# EasyEDA schematic SCH_RE2-YM2612-3438-v0.6_2024-08-18.json

## Sheets
1 MegaMod: TITLE: Sheet_1; REV: 1.0; Date: 2023-11-14; Sheet: 1/1; Drawn By: Denjhang; Company: Your Company
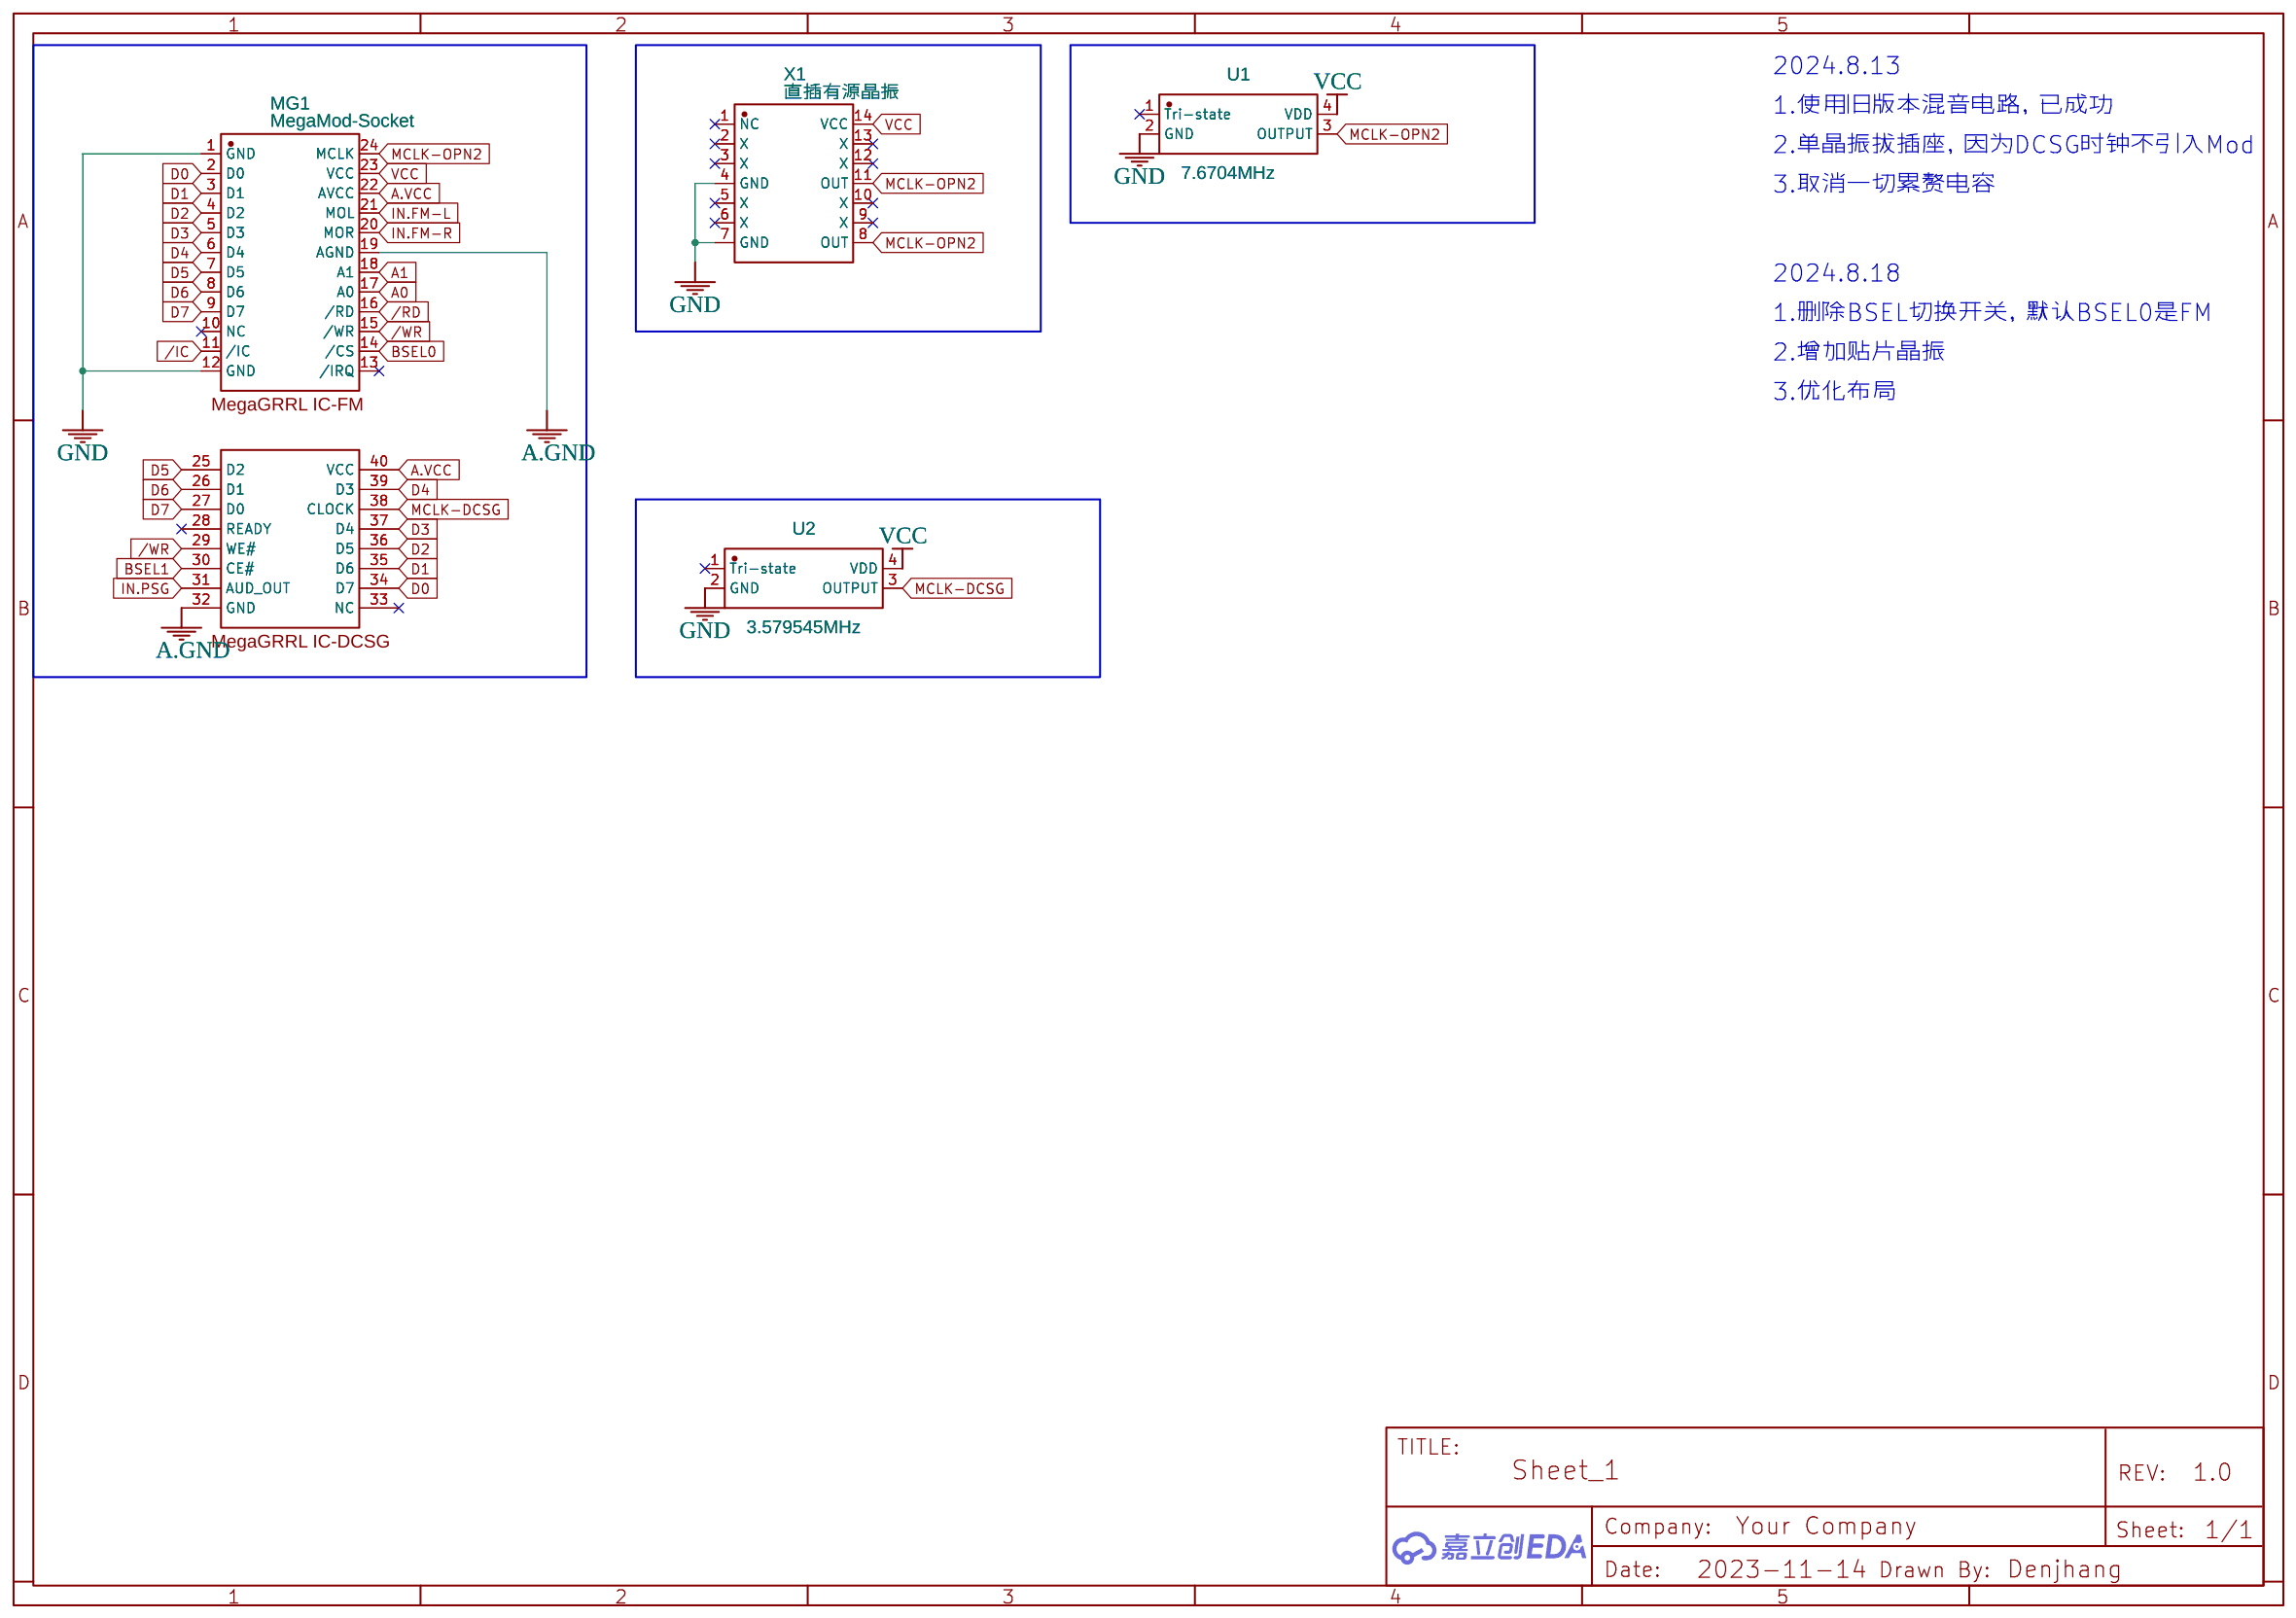
[diagram p0: MegaMod]
2 Mixer
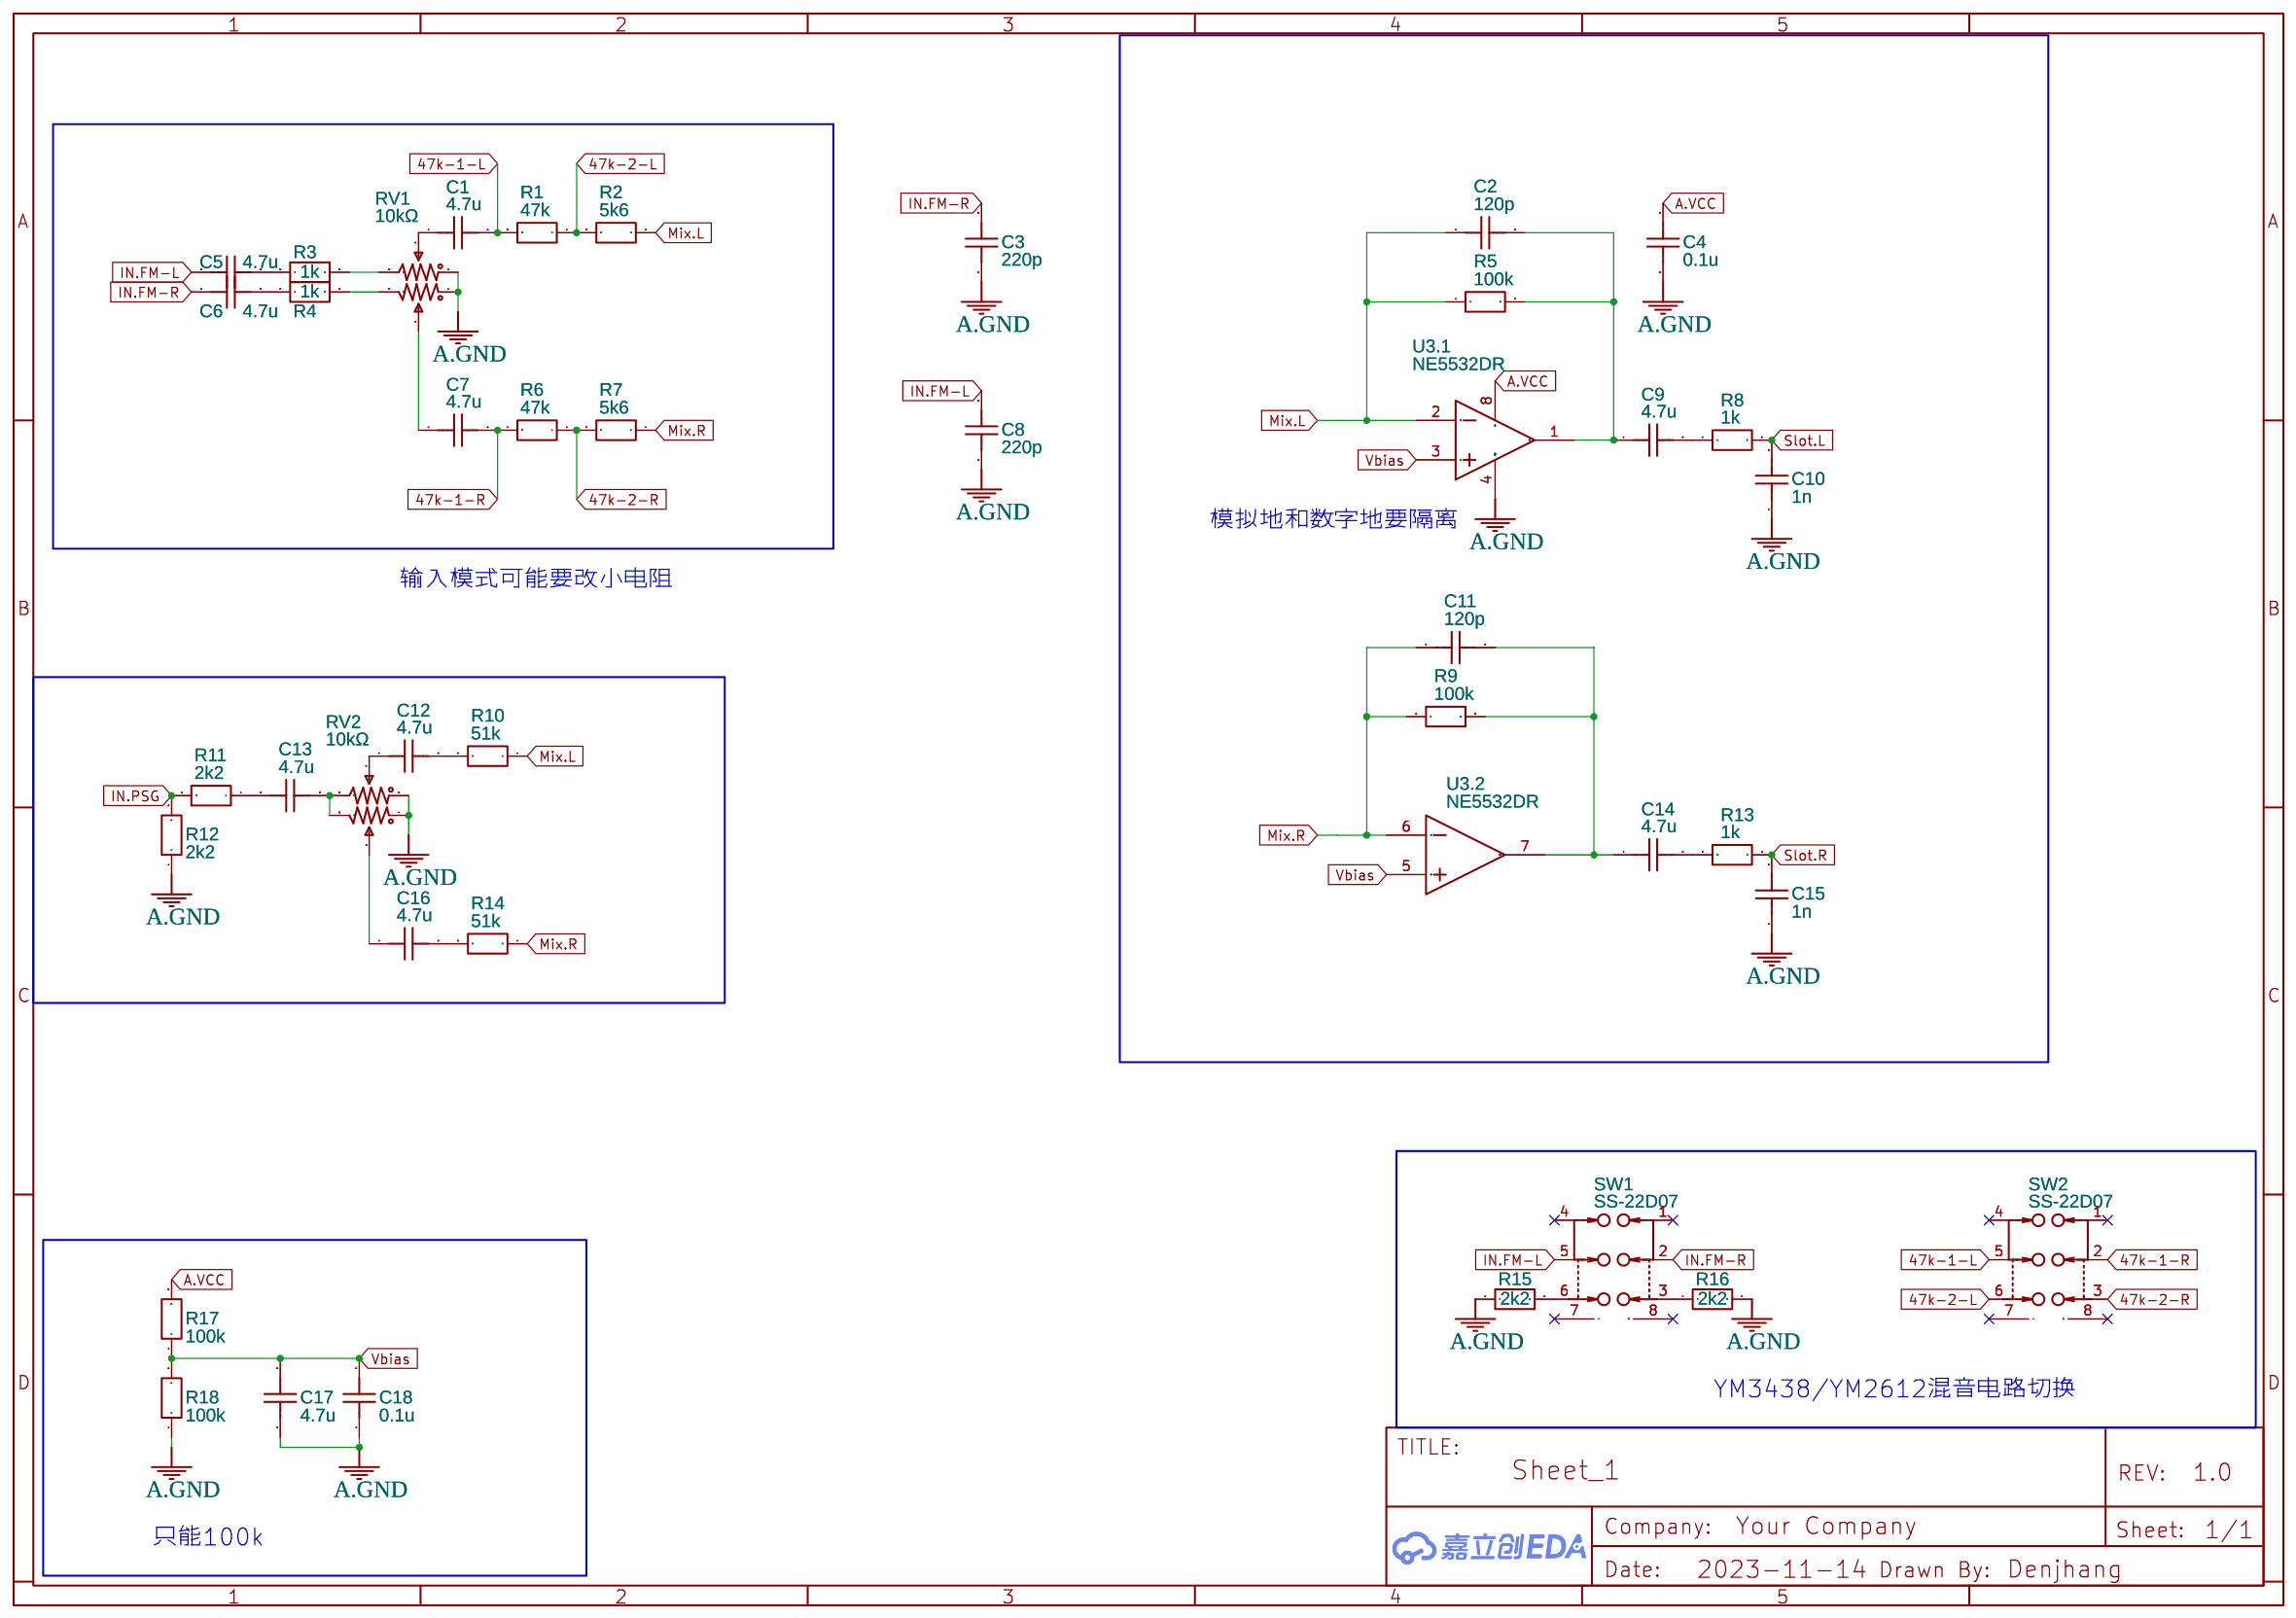
[diagram p1: Mixer]
3 RE-Birth
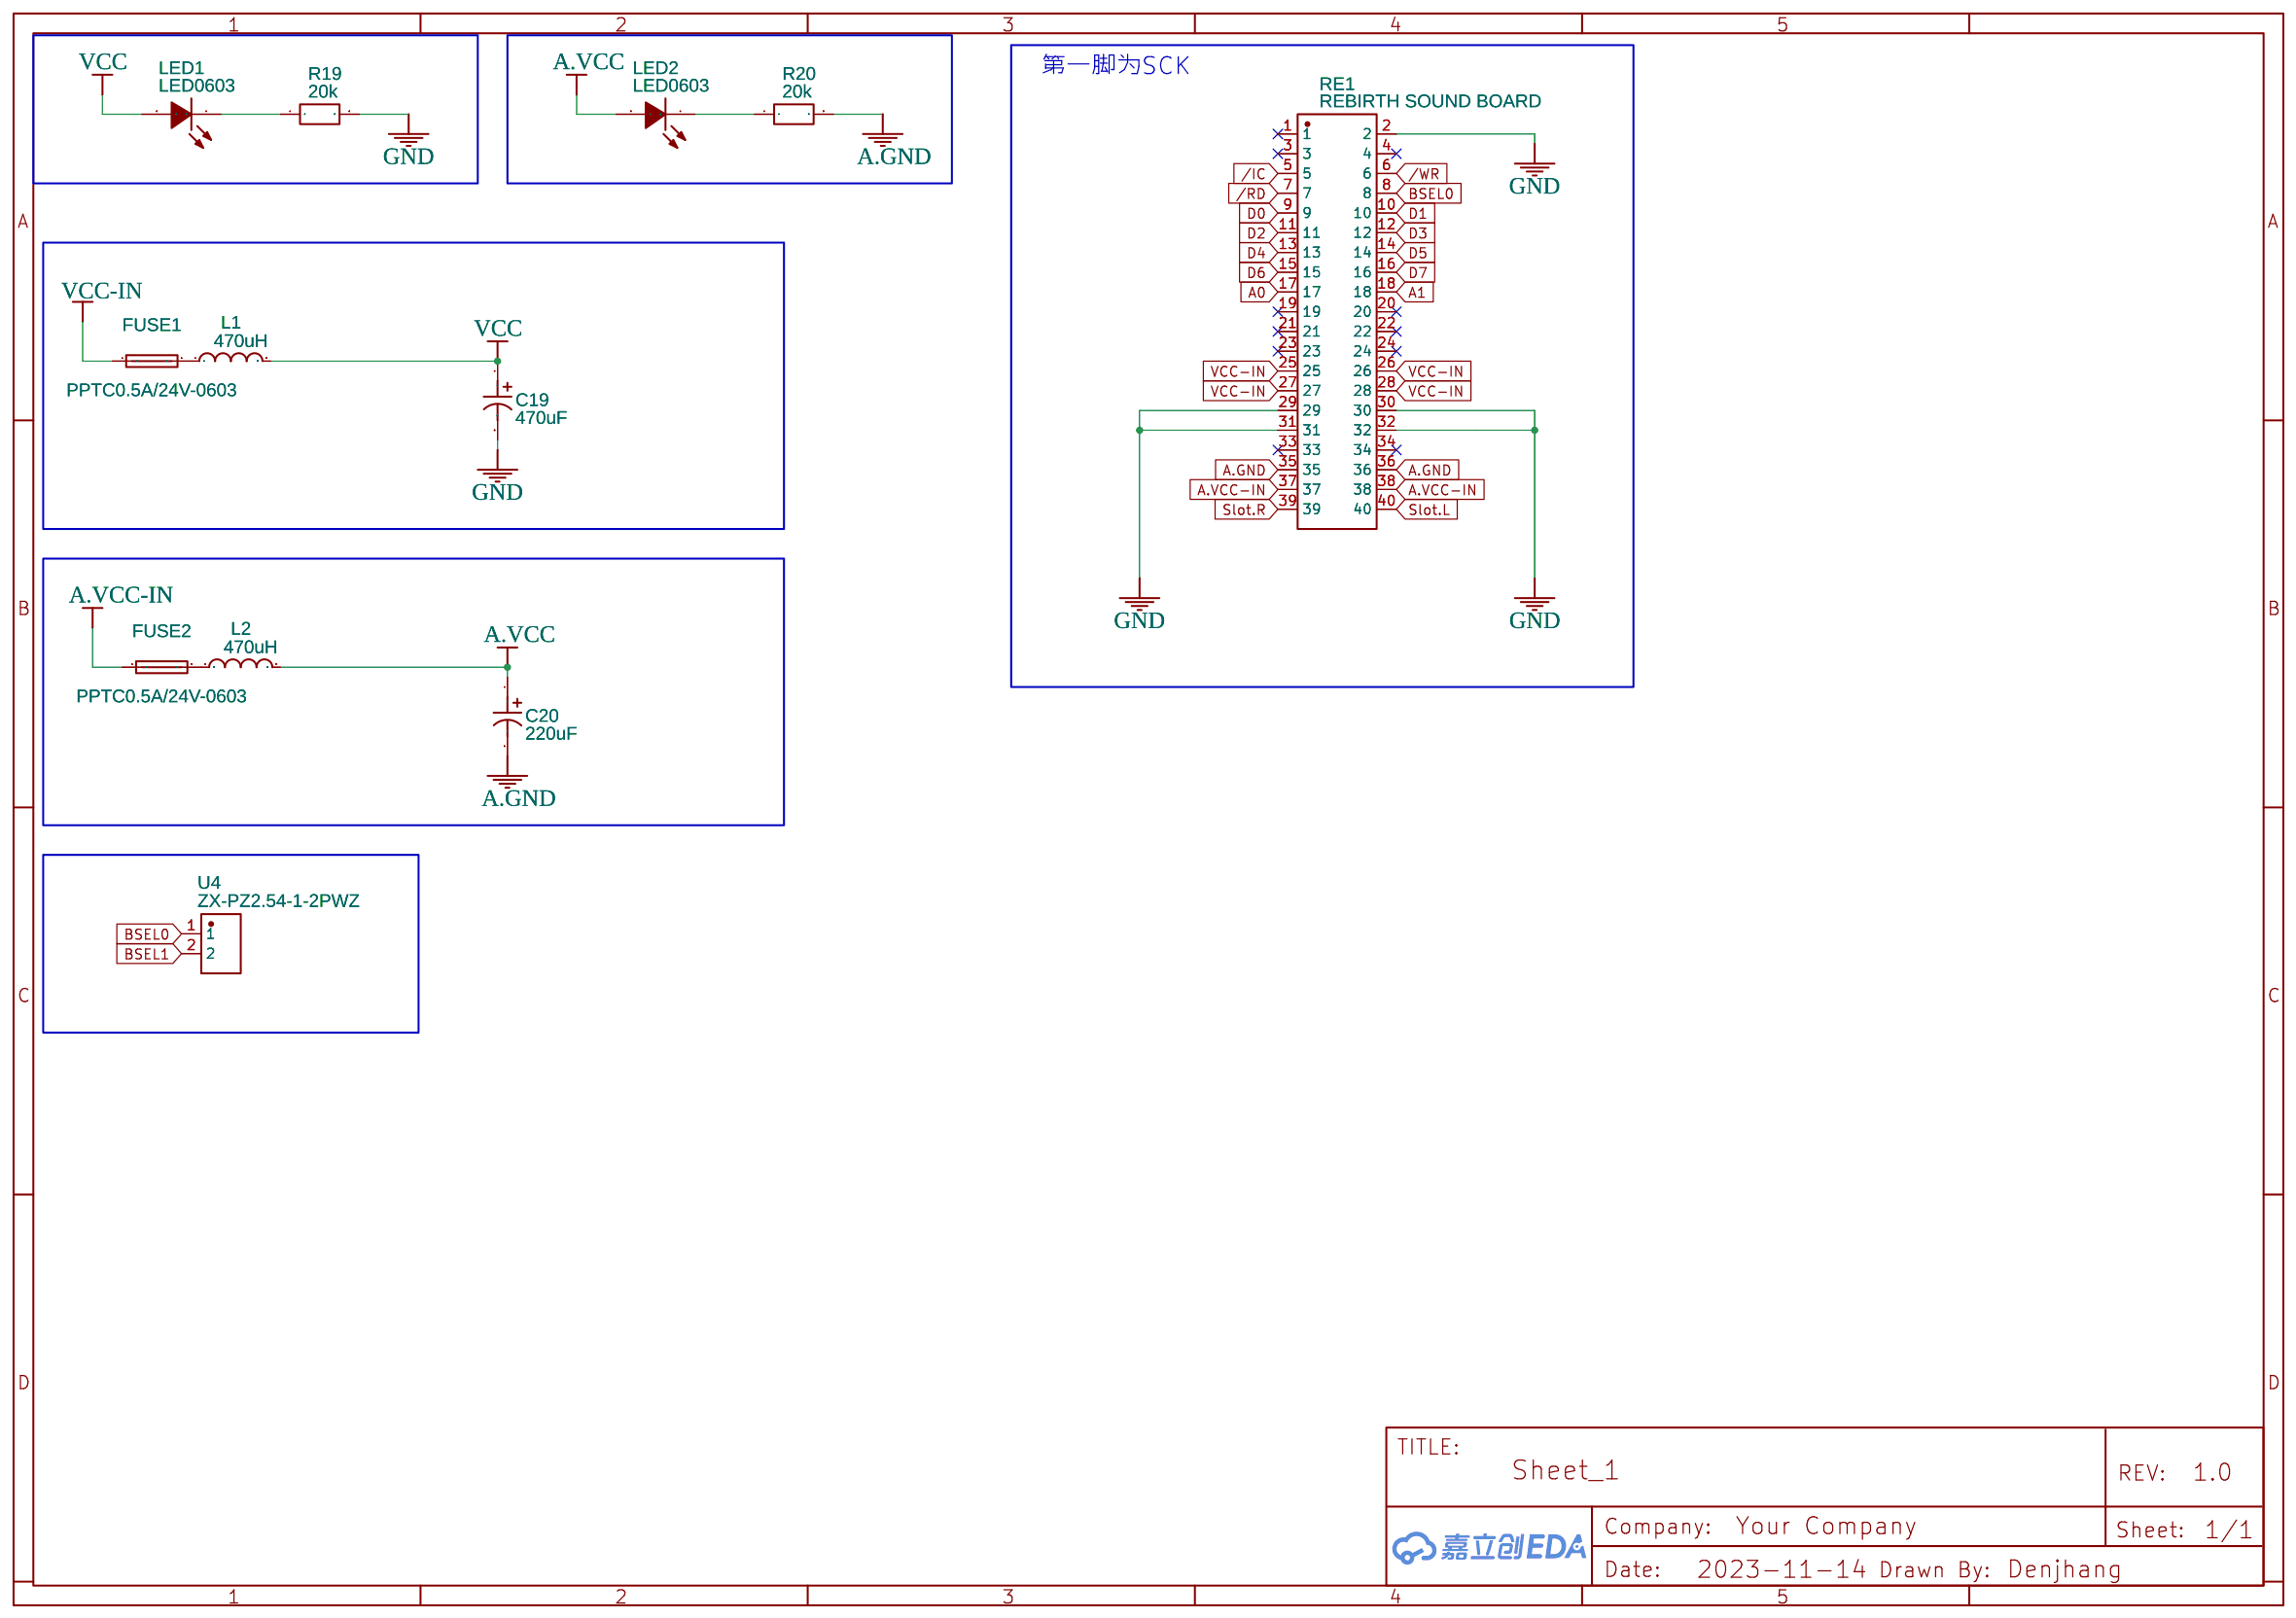
[diagram p2: RE-Birth]

## Parts
sheet MegaMod
MG1  MegaMod-Socket  [MEGAMOD-SOCKET]
U1  7.6704MHz  [OSC-SMD_4P-L3.2-W2.5-BL]
U2  3.579545MHz  [OSC-SMD_4P-L3.2-W2.5-BL]
X1  直插有源晶振  [DIP14-有源晶振]
sheet Mixer
C1  4.7u  [C0603]
C2  120p  [C0603]
C3  220p  [C0603]
C4  0.1u  [C0603]
C5  4.7u  [C0603]
C6  4.7u  [C0603]
C7  4.7u  [C0603]
C8  220p  [C0603]
C9  4.7u  [C0603]
C10  1n  [C0603]
C11  120p  [C0603]
C12  4.7u  [C0603]
C13  4.7u  [C0603]
C14  4.7u  [C0603]
C15  1n  [C0603]
C16  4.7u  [C0603]
C17  4.7u  [C0603]
C18  0.1u  [C0603]
R1  47k  [R0603]
R2  5k6  [R0603]
R3  1k  [R0603]
R4  1k  [R0603]
R5  100k  [R0603]
R6  47k  [R0603]
R7  5k6  [R0603]
R8  1k  [R0603]
R9  100k  [R0603]
R10  51k  [R0603]
R11  2k2  [R0603]
R12  2k2  [R0603]
R13  1k  [R0603]
R14  51k  [R0603]
R15  2k2  [R0603]
R16  2k2  [R0603]
R17  100k  [R0603]
R18  100k  [R0603]
RV1  10kΩ  [RK097G-DJ]
RV2  10kΩ  [RK097G-DJ]
SW1  SS-22D07  [SW-TH_SS-22D07]
SW2  SS-22D07  [SW-TH_SS-22D07]
U3  NE5532DR  [SOIC-8_L4.9-W3.9-P1.27-LS6.0-BL]  (sections 1,2)
sheet RE-Birth
C19  470uF  [CAP-SMD_BD6.3-L6.6-W6.6-FD]
C20  220uF  [CAP-SMD_BD6.3-L6.6-W6.6-LS7.2-FD]
FUSE1  PPTC0.5A/24V-0603  [F0603]
FUSE2  PPTC0.5A/24V-0603  [F0603]
L1  470uH  [IND-SMD_L5.8-W5.2]
L2  470uH  [IND-SMD_L5.8-W5.2]
LED1  LED0603  [LED0603-RD]
LED2  LED0603  [LED0603-RD]
R19  20k  [R0603]
R20  20k  [R0603]
RE1  REBIRTH SOUND BOARD  [REBIRTH SOUND BOARD]
U4  ZX-PZ2.54-1-2PWZ  [HDR-TH_2P-P2.54-H-M-W10.4]

## Library data of the parts
MG1 = MegaMod-Socket: Contributor: denjhang
U1 U2 = OT32254MJBA4SL: Contributor: lcsc; Supplier: LCSC; Supplier Part: C2831397; Manufacturer: YXC(扬兴晶振); JLCPCB Part Class: Extended Part; link: https://so.szlcsc.com/global.html?k=C2831397&ref=editor
X1 = 直插有源晶振: Contributor: denjhang
C1-C18 = C_0603_US: Contributor: LCEDA_Lib
R1-R20 = R_0603_EU: Contributor: LCEDA_Lib
RV1 RV2 = RK097-双连体: Contributor: LCSC; Supplier: LCSC; Supplier Part: C231763; Manufacturer: ALPSALPINE(阿尔卑斯阿尔派); Manufacturer Part: RK09712200MY; JLCPCB Part Class: Extended Part
SW1 SW2 = SS-22D07: Supplier Part: C34982; Supplier: LCSC; Manufacturer: ReliaPro; JLCPCB Part Class: Extended Part; link: https://so.szlcsc.com/global.html?k=C34982&ref=editor
U3 = NE5532DR: image: //image.lceda.cn/szlcsc/C7426.jpg; SMT Type: Basic; subpart_no: 2; Supplier: LCSC; Manufacturer: TI(德州仪器); LCSC Assembly: Yes; Supplier Part: C7426; JLCPCB Part Class: Basic Part; link: https://so.szlcsc.com/global.html?k=C7426&ref=editor
C19 = RVT220UF16V67RV0015: Contributor: LCSC; Supplier: LCSC; Supplier Part: C2887273; Manufacturer: KNSCHA(科尼盛); JLCPCB Part Class: Extended Part; link: https://so.szlcsc.com/global.html?k=C2887273&ref=editor
C20 = RVT47UF35V67RV0039: Contributor: LCSC; Supplier: LCSC; Supplier Part: C2836440; Manufacturer: KNSCHA(科尼盛); JLCPCB Part Class: Extended Part; link: https://so.szlcsc.com/global.html?k=C2836440&ref=editor
FUSE1 FUSE2 = PPTC0.5A/24V-0603: Contributor: LCSC; Supplier: LCSC; Supplier Part: C9900007586; Manufacturer: null; Manufacturer Part: PPTC0.5A/24V 自恢复保险丝-0603; JLCPCB Part Class: Extended Part
L1 L2 = MSCD54-471KT: Contributor: LCSC; Supplier: LCSC; Supplier Part: C915206; Manufacturer: Meled(美莱); JLCPCB Part Class: Extended Part; link: https://so.szlcsc.com/global.html?k=C915206&ref=editor
LED1 LED2 = LED0603: Supplier: LCSC; Supplier Part: C2892154; Manufacturer: GBG; Manufacturer Part: GBG-C192KRKT; link: https://atta.szlcsc.comnull; Contributor: Denjhang
RE1 = REBIRTH SOUND BOARD: Contributor: lcsc; Supplier: LCSC; Supplier Part: C5242133; Manufacturer: XKB Connectivity(中国星坤); Manufacturer Part: X6522WR-2x20H-C60D30-E43F03
U4 = ZX-PZ2.54-1-2PWZ: Supplier: LCSC; Supplier Part: C7501290; Manufacturer: Megastar(兆星); Contributor: lcsc

## Nets
GND: C19.2 MG1.1(GND) MG1.12(GND) R19.2 RE1.2 RE1.29 RE1.30 RE1.31 RE1.32 U1.2(GND) U2.2(GND) X1.4(GND) X1.7(GND)
VCC: C19.1 L1.2 LED1.2(A) MG1.23(VCC) U1.4(VDD) U2.4(VDD) X1.14(VCC)
VCC-IN: FUSE1.1 RE1.25 RE1.26 RE1.27 RE1.28
47k-1-L: C1.2 R1.2 SW2.5
47k-1-R: C7.2 R6.2 SW2.2
47k-2-L: R1.1 R2.2 SW2.6
47k-2-R: R6.1 R7.2 SW2.3
/IC: MG1.11(/IC) RE1.5
/RD: MG1.16(/RD) RE1.7
/WR: MG1.15(/WR) MG1.29(WE#) RE1.6
A0: MG1.17(A0) RE1.17
A1: MG1.18(A1) RE1.18
A.GND: C3.1 C4.1 C8.1 C10.1 C15.1 C17.1 C18.1 C20.2 MG1.19(AGND) MG1.32(GND) R12.1 R15.1 R16.2 R18.1 R20.2 RE1.35 RE1.36 RV1.1 RV1.4 RV2.1 RV2.4 U3.4(VCC-/GND)
A.VCC: C4.2 C20.1 L2.2 LED2.2(A) MG1.22(AVCC) MG1.40(VCC) R17.2 U3.8(VCC+)
A.VCC-IN: FUSE2.1 RE1.37 RE1.38
BSEL0: MG1.14(/CS) RE1.8 U4.1
BSEL1: MG1.30(CE#) U4.2
D0: MG1.2(D0) MG1.34(D7) RE1.9
D1: MG1.3(D1) MG1.35(D6) RE1.10
D2: MG1.4(D2) MG1.36(D5) RE1.11
D3: MG1.5(D3) MG1.37(D4) RE1.12
D4: MG1.6(D4) MG1.39(D3) RE1.13
D5: MG1.7(D5) MG1.25(D2) RE1.14
D6: MG1.8(D6) MG1.26(D1) RE1.15
D7: MG1.9(D7) MG1.27(D0) RE1.16
IN.FM-L: C5.1 C8.2 MG1.21(MOL) SW1.5
IN.FM-R: C3.2 C6.1 MG1.20(MOR) SW1.2
IN.PSG: MG1.31(AUD OUT) R11.2 R12.2
MCLK-DCSG: MG1.38(CLOCK) U2.3(OUTPUT)
MCLK-OPN2: MG1.24(MCLK) U1.3(OUTPUT) X1.8(OUT) X1.11(OUT)
Mix.L: C2.1 R2.1 R5.1 R10.1 U3.2(IN1-)
Mix.R: C11.1 R7.1 R9.1 R14.1 U3.6(IN2-)
Slot.L: C10.2 R8.2 RE1.40
Slot.R: C15.2 R13.2 RE1.39
Vbias: C17.2 C18.2 R17.1 R18.2 U3.3(IN1+) U3.5(IN2+)
Net-(C1-1): C1.1 RV1.2
Net-(C2-2): C2.2 C9.1 R5.2 U3.1(OUT1)
Net-(C5-2): C5.2 R3.1
Net-(C6-2): C6.2 R4.1
Net-(C7-1): C7.1 RV1.5
Net-(C9-2): C9.2 R8.1
Net-(C11-2): C11.2 C14.1 R9.2 U3.7(OUT2)
Net-(C12-1): C12.1 RV2.2
Net-(C12-2): C12.2 R10.2
Net-(C13-1): C13.1 R11.1
Net-(C13-2): C13.2 RV2.3 RV2.6
Net-(C14-2): C14.2 R13.1
Net-(C16-1): C16.1 RV2.5
Net-(C16-2): C16.2 R14.2
Net-(FUSE1-2): FUSE1.2 L1.1
Net-(FUSE2-2): FUSE2.2 L2.1
Net-(LED1-1): LED1.1(C) R19.1
Net-(LED2-1): LED2.1(C) R20.1
Net-(R3-2): R3.2 RV1.3
Net-(R4-2): R4.2 RV1.6
Net-(R15-2): R15.2 SW1.6
Net-(R16-1): R16.1 SW1.3

Not connected (* = marked no-connect by the designer): MG1 10(NC)* 13(/IRQ)* 28(READY)* 33(NC)*; RE1 1* 3* 4* 19* 20* 21* 22* 23* 24* 33* 34*; SW1 1* 4* 7* 8*; SW2 1* 4* 7* 8*; U1 1(Tri-state)*; U2 1(Tri-state)*; X1 1(NC)* 2(X)* 3(X)* 5(X)* 6(X)* 9(X)* 10(X)* 12(X)* 13(X)*

## Notes on the sheets
sheet 1
- 2024.8.13
- 1.使用旧版本混音电路，已成功
- 2.单晶振拔插座，因为DCSG时钟不引入Mod
- 3.取消一切累赘电容
- 2024.8.18
- 1.删除BSEL切换开关，默认BSEL0是FM
- 2.增加贴片晶振
- 3.优化布局
sheet 2
- 模拟地和数字地要隔离
- 输入模式可能要改小电阻
- YM3438/YM2612混音电路切换
- 只能100k
sheet 3
- 第一脚为SCK
